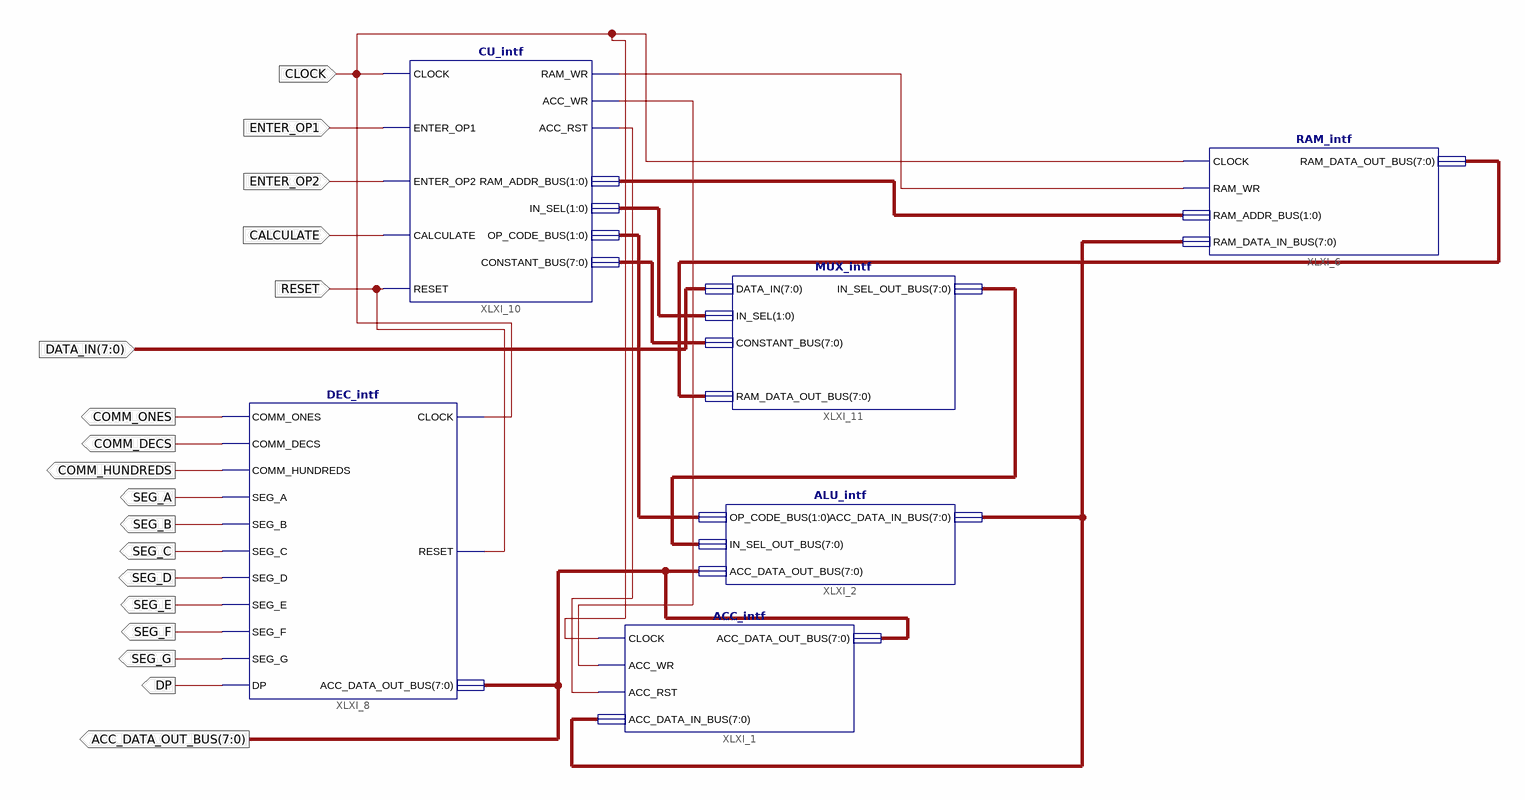
[diagram p0: schematic sheet 1]
// Xilinx ISE schematic TopLevel.sch (spartan3a) as structural Verilog: 6 symbols, 18 ports
module TopLevel (
  input  ENTER_OP1,
  input  ENTER_OP2,
  input  CALCULATE,
  input  [7:0] DATA_IN,
  input  CLOCK,
  input  RESET,
  output COMM_ONES,
  output COMM_DECS,
  output COMM_HUNDREDS,
  output SEG_A,
  output SEG_B,
  output SEG_C,
  output SEG_D,
  output SEG_E,
  output SEG_F,
  output SEG_G,
  output DP,
  output [7:0] ACC_DATA_OUT_BUS
);

  wire XLXN_5, XLXN_11, XLXN_12;
  wire [1:0] XLXN_1, XLXN_6, XLXN_8;
  wire [7:0] XLXN_2, XLXN_4, XLXN_7, XLXN_13;

  RAM_intf XLXI_6 (
    .CLOCK(CLOCK), .RAM_WR(XLXN_5), .RAM_ADDR_BUS(XLXN_6), .RAM_DATA_IN_BUS(XLXN_13),
    .RAM_DATA_OUT_BUS(XLXN_4));
  ALU_intf XLXI_2 (
    .OP_CODE_BUS(XLXN_8), .IN_SEL_OUT_BUS(XLXN_7), .ACC_DATA_OUT_BUS(ACC_DATA_OUT_BUS),
    .ACC_DATA_IN_BUS(XLXN_13));
  ACC_intf XLXI_1 (
    .CLOCK(CLOCK), .ACC_WR(XLXN_12), .ACC_RST(XLXN_11), .ACC_DATA_IN_BUS(XLXN_13),
    .ACC_DATA_OUT_BUS(ACC_DATA_OUT_BUS));
  DEC_intf XLXI_8 (
    .CLOCK(CLOCK), .RESET(RESET), .ACC_DATA_OUT_BUS(ACC_DATA_OUT_BUS), .COMM_ONES(COMM_ONES),
    .COMM_DECS(COMM_DECS), .COMM_HUNDREDS(COMM_HUNDREDS), .SEG_A(SEG_A), .SEG_B(SEG_B), .SEG_C(SEG_C),
    .SEG_D(SEG_D), .SEG_E(SEG_E), .SEG_F(SEG_F), .SEG_G(SEG_G), .DP(DP));
  CU_intf XLXI_10 (
    .CLOCK(CLOCK), .ENTER_OP1(ENTER_OP1), .ENTER_OP2(ENTER_OP2), .CALCULATE(CALCULATE), .RESET(RESET),
    .CONSTANT_BUS(XLXN_2), .RAM_WR(XLXN_5), .ACC_WR(XLXN_12), .ACC_RST(XLXN_11), .RAM_ADDR_BUS(XLXN_6),
    .IN_SEL(XLXN_1), .OP_CODE_BUS(XLXN_8));
  MUX_intf XLXI_11 (
    .DATA_IN(DATA_IN), .IN_SEL(XLXN_1), .CONSTANT_BUS(XLXN_2), .RAM_DATA_OUT_BUS(XLXN_4),
    .IN_SEL_OUT_BUS(XLXN_7));
endmodule
